# EAGLE design optoisolator-shield (EAGLE 7.6.0)
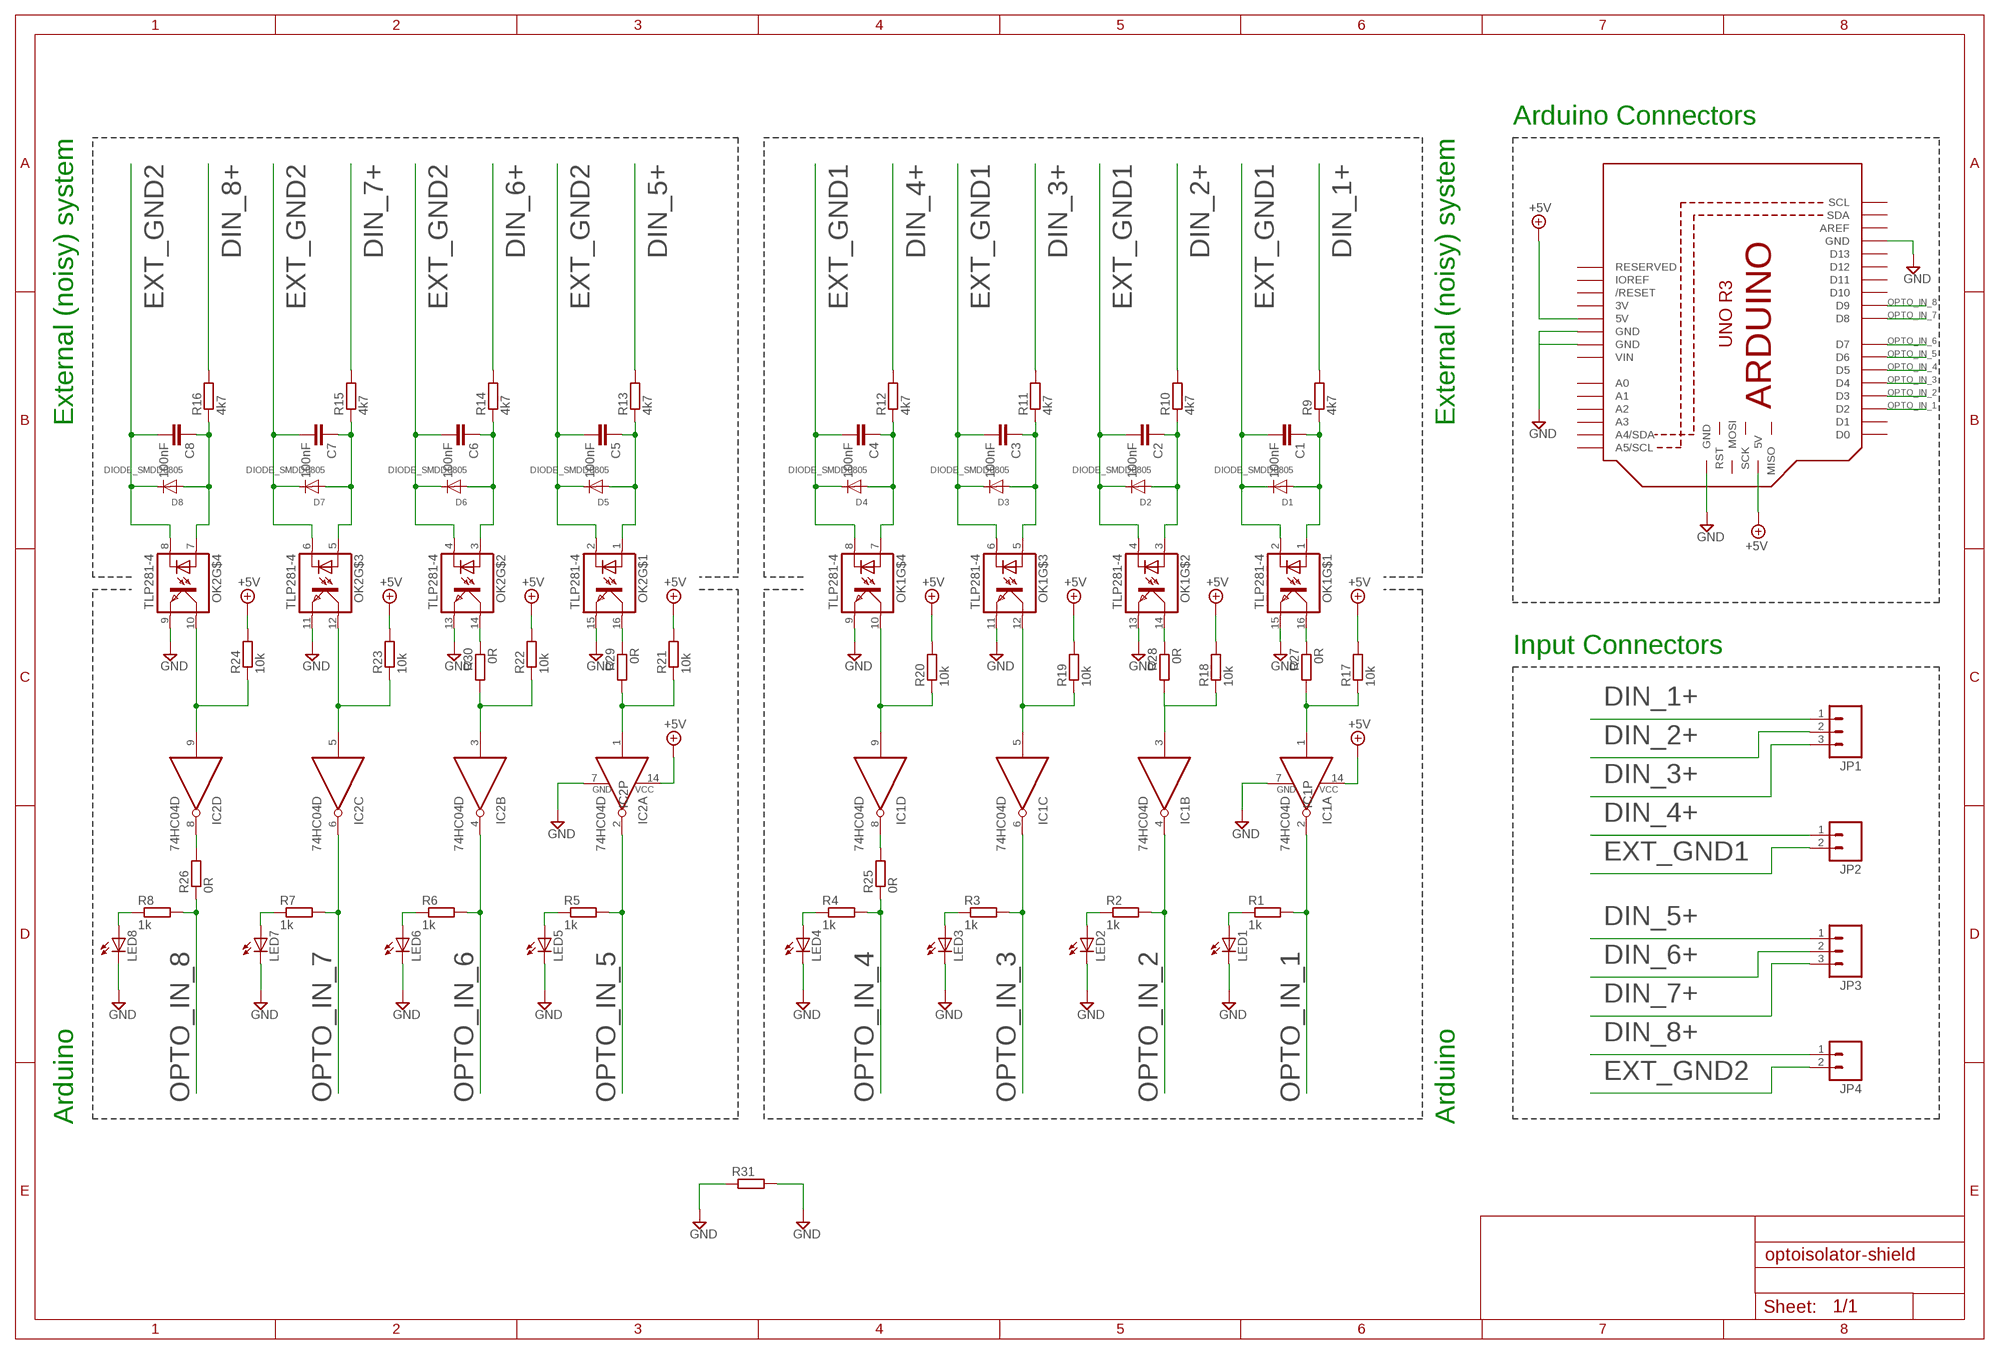
[diagram p0: schematic, sheet 1]

## Parts
C1  100nF  C-EUC0603K  [C0603K]
C2  100nF  C-EUC0603K  [C0603K]
C3  100nF  C-EUC0603K  [C0603K]
C4  100nF  C-EUC0603K  [C0603K]
C5  100nF  C-EUC0603K  [C0603K]
C6  100nF  C-EUC0603K  [C0603K]
C7  100nF  C-EUC0603K  [C0603K]
C8  100nF  C-EUC0603K  [C0603K]
D1  DIODE_SMDD0805  [D0805]
D2  DIODE_SMDD0805  [D0805]
D3  DIODE_SMDD0805  [D0805]
D4  DIODE_SMDD0805  [D0805]
D5  DIODE_SMDD0805  [D0805]
D6  DIODE_SMDD0805  [D0805]
D7  DIODE_SMDD0805  [D0805]
D8  DIODE_SMDD0805  [D0805]
IC1  74HC04D  [SO14]
IC2  74HC04D  [SO14]
JP1  M03SCREW_LOCK  [SCREWTERMINAL-3.5MM-3_LOCK.007S]
JP2  M023.5MM  [SCREWTERMINAL-3.5MM-2]
JP3  M03SCREW_LOCK  [SCREWTERMINAL-3.5MM-3_LOCK.007S]
JP4  M023.5MM  [SCREWTERMINAL-3.5MM-2]
LED1  LEDSML1206  [SML1206]
LED2  LEDSML1206  [SML1206]
LED3  LEDSML1206  [SML1206]
LED4  LEDSML1206  [SML1206]
LED5  LEDSML1206  [SML1206]
LED6  LEDSML1206  [SML1206]
LED7  LEDSML1206  [SML1206]
LED8  LEDSML1206  [SML1206]
M1  ARDUINO_R3_ICSP  [ARDUINOR3_ICSP]
OK1  TLP281-4  [MINI-FLAT-16]
OK2  TLP281-4  [MINI-FLAT-16]
R1  1k  R-EU_R0603  [R0603]
R2  1k  R-EU_R0603  [R0603]
R3  1k  R-EU_R0603  [R0603]
R4  1k  R-EU_R0603  [R0603]
R5  1k  R-EU_R0603  [R0603]
R6  1k  R-EU_R0603  [R0603]
R7  1k  R-EU_R0603  [R0603]
R8  1k  R-EU_R0603  [R0603]
R9  4k7  R-EU_R0603  [R0603]
R10  4k7  R-EU_R0603  [R0603]
R11  4k7  R-EU_R0603  [R0603]
R12  4k7  R-EU_R0603  [R0603]
R13  4k7  R-EU_R0603  [R0603]
R14  4k7  R-EU_R0603  [R0603]
R15  4k7  R-EU_R0603  [R0603]
R16  4k7  R-EU_R0603  [R0603]
R17  10k  R-EU_R0603  [R0603]
R18  10k  R-EU_R0603  [R0603]
R19  10k  R-EU_R0603  [R0603]
R20  10k  R-EU_R0603  [R0603]
R21  10k  R-EU_R0603  [R0603]
R22  10k  R-EU_R0603  [R0603]
R23  10k  R-EU_R0603  [R0603]
R24  10k  R-EU_R0603  [R0603]
R25  0R  R-EU_R2010  [R2010]
R26  0R  R-EU_R2010  [R2010]
R27  0R  R-EU_R2010  [R2010]
R28  0R  R-EU_R2010  [R2010]
R29  0R  R-EU_R2010  [R2010]
R30  0R  R-EU_R2010  [R2010]
R31  R-EU_R1206  [R1206]

## Nets
+5V: IC1.14(P:VCC) IC2.14(P:VCC) M1.5V M1.5V_ICSP(5V) R17.2 R18.2 R19.2 R20.2 R21.2 R22.2 R23.2 R24.2
DIN_1+: JP1.1 R9.2
DIN_2+: JP1.2 R10.2
DIN_3+: JP1.3 R11.2
DIN_4+: JP2.1 R12.2
DIN_5+: JP3.1 R13.2
DIN_6+: JP3.2 R14.2
DIN_7+: JP3.3 R15.2
DIN_8+: JP4.1 R16.2
EXT_GND1: C1.2 C2.2 C3.2 C4.2 D1.K D2.K D3.K D4.K JP2.2 OK1.2(C) OK1.4(C) OK1.6(C) OK1.8(C)
EXT_GND2: C5.2 C6.2 C7.2 C8.2 D5.K D6.K D7.K D8.K JP4.2 OK2.2(C) OK2.4(C) OK2.6(C) OK2.8(C)
GND: IC1.7(P:GND) IC2.7(P:GND) LED1.C LED2.C LED3.C LED4.C LED5.C LED6.C LED7.C LED8.C M1.GND M1.GND@1(GND) M1.GND@2(GND) M1.GND@3(GND) OK1.9(EMIT) OK1.11(EMIT) OK1.13(EMIT) OK1.15(EMIT) OK2.9(EMIT) OK2.11(EMIT) OK2.13(EMIT) OK2.15(EMIT) R31.1 R31.2
N$1: IC1.1(A:I) R17.1 R27.2
N$2: IC1.3(B:I) R18.1 R28.2
N$3: IC1.5(C:I) OK1.12(COL) R19.1
N$4: IC1.9(D:I) OK1.10(COL) R20.1
N$5: IC2.1(A:I) R21.1 R29.2
N$6: IC2.3(B:I) R22.1 R30.2
N$7: IC2.5(C:I) OK2.12(COL) R23.1
N$8: IC2.9(D:I) OK2.10(COL) R24.1
N$9: OK2.16(COL) R29.1
N$10: IC1.8(D:O) R25.2
N$11: IC2.8(D:O) R26.2
N$12: OK1.16(COL) R27.1
N$13: OK1.14(COL) R28.1
N$14: OK2.14(COL) R30.1
N$17: C1.1 D1.A OK1.1(A) R9.1
N$18: C2.1 D2.A OK1.3(A) R10.1
N$19: C3.1 D3.A OK1.5(A) R11.1
N$20: C4.1 D4.A OK1.7(A) R12.1
N$21: C5.1 D5.A OK2.1(A) R13.1
N$22: C6.1 D6.A OK2.3(A) R14.1
N$23: C7.1 D7.A OK2.5(A) R15.1
N$24: C8.1 D8.A OK2.7(A) R16.1
N$25: LED1.A R1.1
N$26: LED2.A R2.1
N$27: LED3.A R3.1
N$28: LED4.A R4.1
N$29: LED5.A R5.1
N$30: LED6.A R6.1
N$31: LED7.A R7.1
N$32: LED8.A R8.1
OPTO_IN_1: IC1.2(A:O) M1.D2 R1.2
OPTO_IN_2: IC1.4(B:O) M1.D3 R2.2
OPTO_IN_3: IC1.6(C:O) M1.D4 R3.2
OPTO_IN_4: M1.D5 R4.2 R25.1
OPTO_IN_5: IC2.2(A:O) M1.D6 R5.2
OPTO_IN_6: IC2.4(B:O) M1.D7 R6.2
OPTO_IN_7: IC2.6(C:O) M1.D8 R7.2
OPTO_IN_8: M1.D9 R8.2 R26.1
Unconnected: IC1.10(E:O) IC1.11(E:I) IC1.12(F:O) IC1.13(F:I) IC2.10(E:O) IC2.11(E:I) IC2.12(F:O) IC2.13(F:I) M1.A0 M1.A1 M1.A2 M1.A3 M1.A4(A4/SDA) M1.A5(A5/SCL) M1.AREF M1.D0 M1.D1 M1.D10 M1.D11 M1.D12 M1.D13 M1.IOREF M1.MISO M1.MOSI M1.RESERVED M1.RESET(/RESET) M1.RESET_ICSP(RST) M1.SCK M1.SCL M1.SDA

## Notes on the sheet
- Arduino Connectors
- External (noisy) system | External (noisy) system
- Input Connectors
- Arduino | Arduino

## Power pins joined to a net without a drawn wire
3V: M1.3V
VIN: M1.VIN

## Library data of the parts
C1-C8 = rcl:C-EU: CAPACITOR, European symbol
D1-D8 = diodes_gen:DIODE_SMD: General Purpose Diode Library Unspecified diode types but packages D0805 doplnit D0605 D1206 SMA SMB SMC SOD123 SOD323 Diodes in 0603 package Typ Farnell number Link Notes TS4148RZG 8150192 Link <http://cz.farnell.com/taiwan-semiconductor/ts4148-rzg/diode-0-35a-603/dp/8150192> 1N41448 alt CD0603-S01xxx 7599754 Link <http://cz.farnell.com/bourns/cd0603-s0180r/switching-diode-90v-100ma-0603/dp/7599754> 1N41448 alt Diodes in 0805 package Typ Farnell number Link Notes TS4148RY 8150206 Link <http://cz.farnell.com/taiwan-semiconductor/ts4148-ry/diode-0-5a-0805-100v/dp/8150206> 1n4148 alt Diodes in 1202 package Typ Farnell number Link Notes TS4148RX 8150214 Link <http://cz.farnell.com/taiwan-semiconductor/ts4148-rx/diode-small-signal-100v-0-15a-1206/dp/8150214> CD1206-S01575 7599821 Link <http://cz.farnell.com/bourns/cd1206-s01575/switching-diode-100v-150ma-1206/dp/7599821> Diodes in SOD123 package Typ Farnell number Link Notes Link Diodes in SOD323 package Typ Farnell number Link Notes Link Diodes in SMA package Typ Farnell number Link Notes Link Diodes in SMB package Typ Farnell number Link Notes Link Diodes in SMC package Typ Farnell number Link Notes Link
IC1 IC2 = 74xx-eu:74*04: Hex INVERTER
JP1 JP3 = SparkFunOld:M03: Header 3 Standard 3-pin 0.1" header. Use with straight break away headers (SKU : PRT-00116), right angle break away headers (PRT-00553), swiss pins (PRT-00743), machine pins (PRT-00117), and female headers (PRT-00115). Molex polarized connector foot print use with SKU : PRT-08232 with associated crimp pins and housings.
JP2 JP4 = SparkFunOld:M02: Header 2 Standard 2-pin 0.1" header. Use with straight break away headers (SKU : PRT-00116), right angle break away headers (PRT-00553), swiss pins (PRT-00743), machine pins (PRT-00117), and female headers (PRT-00115). Molex polarized connector foot print use with SKU : PRT-08233 with associated crimp pins and housings.
LED1-LED8 = led:LED: LED OSRAM: - CHIPLED LG R971, LG N971, LY N971, LG Q971, LY Q971, LO R971, LY R971 LH N974, LH R974 LS Q976, LO Q976, LY Q976 LO Q996 - Hyper CHIPLED LW Q18S LB Q993, LB Q99A, LB R99A - SideLED LS A670, LO A670, LY A670, LG A670, LP A670 LB A673, LV A673, LT A673, LW A673 LH A674 LY A675 LS A676, LA A676, LO A676, LY A676, LW A676 LS A679, LY A679, LG A679 - Hyper Micro SIDELED® LS Y876, LA Y876, LO Y876, LY Y876 LT Y87S - SmartLED LW L88C, LW L88S LB L89C, LB L89S, LG L890 LS L89K, LO L89K, LY L89K LS L896, LA L896, LO L896, LY L896 - TOPLED LS T670, LO T670, LY T670, LG T670, LP T670 LSG T670, LSP T670, LSY T670, LOP T670, LYG T670 LG T671, LOG T671, LSG T671 LB T673, LV T673, LT T673, LW T673 LH T674 LS T676, LA T676, LO T676, LY T676, LB T676, LH T676, LSB T676, LW T676 LB T67C, LV T67C, LT T67C, LS T67K, LO T67K, LY T67K, LW E67C LS E67B, LA E67B, LO E67B, LY E67B, LB E67C, LV E67C, LT E67C LW T67C LS T679, LY T679, LG T679 LS T770, LO T770, LY T770, LG T770, LP T770 LB T773, LV T773, LT T773, LW T773 LH T774 LS E675, LA E675, LY E675, LS T675 LS T776, LA T776, LO T776, LY T776, LB T776 LHGB T686 LT T68C, LB T68C - Hyper Mini TOPLED® LB M676 - Mini TOPLED Santana® LG M470 LS M47K, LO M47K, LY M47K Source: http://www.osram.convergy.de LUXEON: - LUMILED® LXK2-PW12-R00, LXK2-PW12-S00, LXK2-PW14-U00, LXK2-PW14-V00 LXK2-PM12-R00, LXK2-PM12-S00, LXK2-PM14-U00 LXK2-PE12-Q00, LXK2-PE12-R00, LXK2-PE12-S00, LXK2-PE14-T00, LXK2-PE14-U00 LXK2-PB12-K00, LXK2-PB12-L00, LXK2-PB12-M00, LXK2-PB14-N00, LXK2-PB14-P00, LXK2-PB14-Q00 LXK2-PR12-L00, LXK2-PR12-M00, LXK2-PR14-Q00, LXK2-PR14-R00 LXK2-PD12-Q00, LXK2-PD12-R00, LXK2-PD12-S00 LXK2-PH12-R00, LXK2-PH12-S00 LXK2-PL12-P00, LXK2-PL12-Q00, LXK2-PL12-R00 Source: www.luxeon.com KINGBRIGHT: KA-3528ASYC Source: www.kingbright.com
M1 = adafruit:ARDUINO_R3_ICSP
OK1 OK2 = optocoupler:TLP281-4: TOSHIBA PHOTOCOUPLER GaAs IRED & PHOTO-TRANSISTOR Source: http://www.alldatasheet.com/datasheet-pdf/pdf/32424/TOSHIBA/TLP281.html214960/TOSHIBA/TLP281-4.html
R1-R24 = rcl:R-EU_: RESISTOR, European symbol
R25-R31 = resistor:R-EU_: RESISTOR, European symbol

## Board
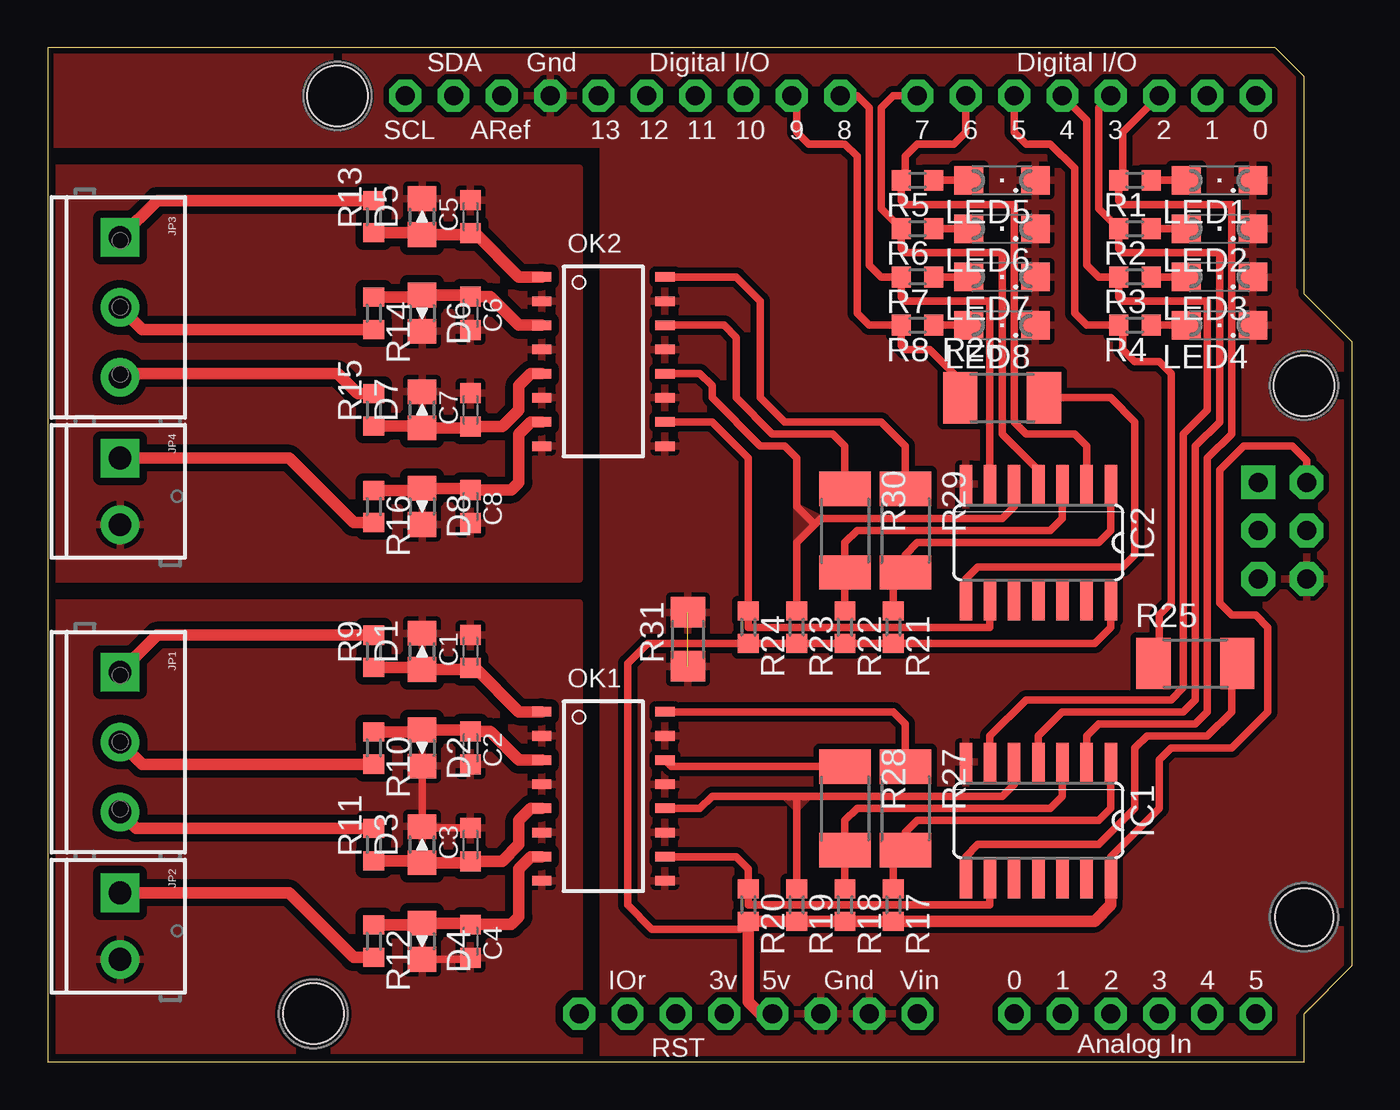
[diagram p1: board, top side]

Size 68.58 x 53.34 mm. Coordinates in mm from the lower left corner, seen from the top.
Copper layers (1*16): Top 0.035mm / dielectric 1.5mm / Bottom 0.035mm
Design rules "default *": minimum track width 40mil, minimum drill 24mil, track to track 8mil, track to pad 8mil, pad to pad 8mil, via to via 8mil, smd to smd 8mil, copper to edge 12mil, drill to drill 8mil, minimum pad ring 10mil, minimum via ring 8mil, stop-mask expansion 4mil, vias tented up to drill 0mil, thermal gap 10mil
Holes 3.17 mm at 13.97,2.54 15.24,50.8 66.04,35.56
Holes 3.05 mm at 66.04,7.62

### Footprints (pad centres in the part's own frame; a part is rotated, then mirrored left to right if it is on the bottom)
C0603K = smd 1.05 x 1.08: 1 -0.875,0; 2 0.875,0
D0805 = smd 1.3 x 1.5: A -0.95,0; K 0.95,0
SO14 = smd 0.66 x 2.032: 1 -3.81,-3.073; 2 -2.54,-3.073; 3 -1.27,-3.073; 4 0,-3.073; 5 1.27,-3.073; 6 2.54,-3.073; 7 3.81,-3.073; 8 3.81,3.073; 9 2.54,3.073; 10 1.27,3.073; 11 0,3.073; 12 -1.27,3.073; 13 -2.54,3.073; 14 -3.81,3.073
SCREWTERMINAL-3.5MM-3_LOCK.007S = drill 1.2 pad 2.032 square: 1 -0.178,0 | drill 1.2 pad 2.032: 2 3.5,0; 3 7.178,0
SCREWTERMINAL-3.5MM-2 = drill 1.2 pad 2.032 square: 1 0,0 | drill 1.2 pad 2.032: 2 3.5,0
SML1206 = smd 1.5 x 1.5: A 1.75,0; C -1.75,0
ARDUINOR3_ICSP = drill 1 pad 1.676 octagon: 3V 35.56,2.54; 5V 38.1,2.54; A0 50.8,2.54; A1 53.34,2.54; A2 55.88,2.54; A3 58.42,2.54; A4 60.96,2.54; A5 63.5,2.54; AREF 23.876,50.8; D0 63.5,50.8; D1 60.96,50.8; D2 58.42,50.8; D3 55.88,50.8; D4 53.34,50.8; D5 50.8,50.8; D6 48.26,50.8; D7 45.72,50.8; D8 41.656,50.8; D9 39.116,50.8; D10 36.576,50.8; D11 34.036,50.8; D12 31.496,50.8; D13 28.956,50.8; GND 26.416,50.8; GND@1 43.18,2.54; GND@2 40.64,2.54; IOREF 30.48,2.54; RESERVED 27.94,2.54; RESET 33.02,2.54; SCL 18.796,50.8; SDA 21.336,50.8; VIN 45.72,2.54 | drill 1 pad 1.778 octagon: 5V_ICSP 66.167,30.48; GND@3 66.167,25.4; MOSI 66.167,27.94; RESET_ICSP 63.627,25.4; SCK 63.627,27.94 | drill 1 pad 1.778 square: MISO 63.627,30.48
MINI-FLAT-16 = smd 1 x 0.5: 1 -3.24,4.445; 2 -3.24,3.175; 3 -3.24,1.905; 4 -3.24,0.635; 5 -3.24,-0.635; 6 -3.24,-1.905; 7 -3.24,-3.175; 8 -3.24,-4.445; 9 3.24,-4.445; 10 3.24,-3.175; 11 3.24,-1.905; 12 3.24,-0.635; 13 3.24,0.635; 14 3.24,1.905; 15 3.24,3.175; 16 3.24,4.445
R0603 = smd 1 x 1.1: 1 -0.85,0; 2 0.85,0
R2010 = smd 1.8 x 2.7: 1 -2.2,0; 2 2.2,0
R1206 = smd 1.6 x 1.803: 1 -1.422,0; 2 1.422,0

### Placement (x,y rotation side)
C1  22.23,21.59 90 top
C2  22.23,16.51 270 top
C3  22.23,11.43 90 top
C4  22.23,6.35 270 top
C5  22.23,44.45 90 top
C6  22.23,39.37 270 top
C7  22.23,34.29 90 top
C8  22.23,29.21 270 top
D1  19.68,21.59 90 top
D2  19.68,16.51 270 top
D3  19.68,11.43 90 top
D4  19.68,6.35 270 top
D5  19.68,44.45 90 top
D6  19.68,39.37 270 top
D7  19.68,34.29 90 top
D8  19.68,29.21 270 top
IC1  52.07,12.7 180 top
IC2  52.07,27.3 180 top
JP1  3.81,20.32 270 top
JP2  3.81,8.89 270 top
JP3  3.81,43.18 270 top
JP4  3.81,31.75 270 top
LED1  61.59,46.35 180 top
LED2  61.59,43.81 180 top
LED3  61.59,41.27 180 top
LED4  61.59,38.73 180 top
LED5  50.16,46.35 180 top
LED6  50.16,43.81 180 top
LED7  50.16,41.27 180 top
LED8  50.16,38.73 180 top
M1  0,0 0 top
OK1  29.21,13.97 0 top
OK2  29.21,36.83 0 top
R1  57.15,46.35 180 top
R2  57.15,43.81 180 top
R3  57.15,41.27 180 top
R4  57.15,38.73 180 top
R5  45.72,46.35 180 top
R6  45.72,43.81 180 top
R7  45.72,41.27 180 top
R8  45.72,38.73 180 top
R9  17.14,21.59 90 top
R10  17.14,16.51 270 top
R11  17.14,11.43 90 top
R12  17.14,6.35 270 top
R13  17.14,44.45 90 top
R14  17.14,39.37 270 top
R15  17.14,34.29 90 top
R16  17.14,29.21 270 top
R17  44.45,8.26 270 top
R18  41.91,8.26 270 top
R19  39.37,8.26 270 top
R20  36.83,8.26 270 top
R21  44.45,22.86 270 top
R22  41.91,22.86 270 top
R23  39.37,22.86 270 top
R24  36.83,22.86 270 top
R25  60.33,20.95 0 top
R26  50.16,34.92 0 top
R27  45.09,13.34 270 top
R28  41.91,13.34 270 top
R29  45.09,27.94 270 top
R30  41.91,27.94 270 top
R31  33.66,22.23 90 top

### Tracks (layer width: path | path; a pad name or v marks a point on that pad's centre or on a via)
+5V
  Top 0.406: IC2.14 55.88,22.86 55.03,22.01 R21.2 R22.2 R23.2 R24.2 31.54,22.01 30.48,20.95 30.48,8.26 31.75,6.99 36.41,6.99 R20.2 | IC1.14 55.88,10.79 58.42,13.34 58.42,15.88 59.05,16.51 62.23,16.51 64.14,18.41 64.14,22.86 63.5,23.5 62.23,23.5 61.59,24.13 61.59,31.11 62.87,32.38 65.41,32.38 66.17,31.62 M1.5V_ICSP
  Top 0.61: IC1.14 55.88,8.26 55.03,7.41 R17.2 R18.2 R19.2 R20.2 36.83,3.17 37.47,2.54 M1.5V
DIN_1+
  Top 0.61: R9.2 5.75,22.44 JP1.1
DIN_2+
  Top 0.61: R10.2 4.97,15.66 JP1.2
DIN_3+
  Top 0.61: R11.2 4.67,12.28 JP1.3
DIN_4+
  Top 0.61: R12.2 16.09,5.5 12.7,8.89 JP2.1
DIN_5+
  Top 0.61: R13.2 5.75,45.3 JP3.1
DIN_6+
  Top 0.61: R14.2 4.97,38.52 JP3.2
DIN_7+
  Top 0.61: R15.2 16.3,35.14 15.24,36.2 4,36.2 JP3.3
DIN_8+
  Top 0.61: R16.2 16.09,28.36 12.7,31.75 JP4.1
EXT_GND1
  Top 0.406: C3.2 19.76,12.3 D3.K D2.K | D4.K 22.15,5.4 C4.2
  pour Top (isolate 0.406): 0,24.13 27.94,24.13 27.94,0 0,0
EXT_GND2
  pour Top (isolate 0.406): 0,46.99 27.94,46.99 27.94,25.4 0,25.4
GND  (1 unrouted)
  pour Top (isolate 0.305): 0,48.26 29.21,48.26 29.21,0 65.41,0 65.41,2.54 67.94,5.08 67.94,38.1 65.41,40.64 65.41,52.07 64.14,53.34 0,53.34
N$1
  Top 0.406: IC1.1 55.88,13.34 55.24,12.7 45.72,12.7 45.09,12.06 R27.2 44.79,11.43 44.45,11.43 R17.1
N$2
  Top 0.406: IC1.3 53.34,13.97 52.7,13.34 42.55,13.34 41.91,12.7 R28.2 R18.1
N$3
  Top 0.406: 39.37,13.97 34.92,13.97 34.29,13.34 OK1.12 | 39.37,13.97 50.16,13.97 50.8,14.61 IC1.5 | R19.1 39.37,13.97
  pour Top: 38.73,13.97 39.37,13.34 40.01,13.97
N$4
  Top 0.406: IC1.9 49.53,8.26 36.83,8.26 R20.1 36.83,10.16 36.2,10.79 OK1.10
N$5
  Top 0.406: R21.1 44.45,25.11 R29.2 45.09,26.67 45.72,27.3 55.24,27.3 55.88,27.94 IC2.1
N$6
  Top 0.406: IC2.3 53.34,28.57 52.7,27.94 42.55,27.94 41.91,27.3 R30.2 R22.1
N$7
  Top 0.406: R23.1 39.37,27.3 40.32,28.26 | 40.32,28.26 40.64,28.57 50.16,28.57 50.8,29.21 IC2.5 | OK2.12 34.29,36.2 34.92,35.56 34.92,34.92 37.47,32.38 38.73,32.38 39.37,31.75 39.37,29.21 40.32,28.26
  pour Top: 39.37,29.21 39.37,27.3 40.64,28.57
N$8
  Top 0.406: IC2.9 49.53,22.86 36.83,22.86 R24.1 36.83,31.75 34.92,33.66 OK2.10
N$9
  Top 0.406: R29.1 45.09,32.38 43.81,33.66 38.73,33.66 37.47,34.92 37.47,40.01 36.2,41.27 OK2.16
N$10
  Top 0.406: IC1.8 48.26,10.79 48.9,11.43 55.24,11.43 57.15,13.34 57.15,16.51 57.78,17.14 60.96,17.14 62.23,18.41 62.23,21.93 R25.2
N$11
  Top 0.406: R26.2 55.88,34.92 57.15,33.66 57.15,26.67 56.52,26.04 48.9,26.04 48.26,25.4 IC2.8
N$12
  Top 0.406: R27.1 45.09,17.78 44.45,18.41 OK1.16
N$13
  Top 0.406: R28.1 32.79,15.54 OK1.14
N$14
  Top 0.406: R30.1 41.91,32.38 41.27,33.02 38.1,33.02 36.2,34.92 36.2,38.1 35.56,38.73 OK2.14
N$17
  Top 0.406: 19.59,20.74 D1.A | 22.15,20.64 C1.1 22.46,20.71
  Top 0.61: R9.1 19.59,20.74 | D1.A 22.15,20.64 | 22.46,20.71 24.77,18.41 OK1.1
N$18
  Top 0.406: 19.59,17.36 D2.A | 22.15,17.46 C2.1
  Top 0.61: R10.1 19.59,17.36 | D2.A 22.15,17.46 | C2.1 23.25,17.39 24.77,15.88 OK1.3
N$19
  Top 0.406: 19.59,10.58 D3.A | 22.15,10.48 C3.1
  Top 0.61: R11.1 19.59,10.58 | D3.A 22.15,10.48 | C3.1 23.89,10.55 24.77,11.43 24.77,12.7 25.4,13.34 OK1.5
N$20
  Top 0.406: 19.59,7.2 D4.A | 22.15,7.3 C4.1
  Top 0.61: R12.1 19.59,7.2 | D4.A 22.15,7.3 | C4.1 24.37,7.22 24.77,7.62 24.77,10.16 25.4,10.79 OK1.7
N$21
  Top 0.406: C5.1 22.46,43.58
  Top 0.61: R13.1 19.59,43.6 D5.A 22.15,43.5 C5.1 | 22.46,43.58 24.77,41.27 OK2.1
N$22
  Top 0.61: R14.1 19.59,40.22 D6.A 22.15,40.32 C6.1 23.25,40.24 24.77,38.73 OK2.3
N$23
  Top 0.61: R15.1 19.59,33.44 D7.A 22.15,33.34 C7.1 23.89,33.41 24.77,34.29 24.77,35.56 25.4,36.2 OK2.5
N$24
  Top 0.61: R16.1 19.59,30.06 D8.A 22.15,30.16 C8.1 24.37,30.09 24.77,30.48 24.77,33.02 25.4,33.66 OK2.7
N$25
  Top 0.406: R1.1 LED1.A
N$26
  Top 0.406: R2.1 LED2.A
N$27
  Top 0.406: R3.1 LED3.A
N$28
  Top 0.406: R4.1 LED4.A
N$29
  Top 0.406: LED5.A R5.1
N$30
  Top 0.406: LED6.A R6.1
N$31
  Top 0.406: LED7.A R7.1
N$32
  Top 0.406: LED8.A R8.1
OPTO_IN_1
  Top 0.406: IC1.2 54.61,17.14 55.24,17.78 60.33,17.78 60.96,18.41 60.96,31.75 62.23,33.02 62.23,45.09 56.52,45.09 56.3,45.3 R1.2 56.52,46.57 56.52,48.9 M1.D2
OPTO_IN_2
  Top 0.406: IC1.4 52.07,17.14 53.34,18.41 59.69,18.41 60.33,19.05 60.33,32.38 61.59,33.66 61.59,42.55 56.52,42.55 56.3,42.76 R2.2 55.24,44.87 55.24,50.16 M1.D3
OPTO_IN_3
  Top 0.406: IC1.6 49.53,17.14 51.44,19.05 59.05,19.05 59.69,19.68 59.69,33.02 60.96,34.29 60.96,40.01 56.52,40.01 56.3,40.22 R3.2 55.24,41.27 54.61,41.91 54.61,49.53 M1.D4
OPTO_IN_4
  Top 0.406: R25.1 58.12,21.59 58.42,21.59 58.42,23.5 59.05,24.13 59.05,36.2 58.42,36.83 57.15,36.83 56.52,37.47 56.52,38.52 R4.2 54.61,38.73 53.98,39.37 53.98,46.99 52.7,48.26 51.44,48.26 50.8,48.9 M1.D5
OPTO_IN_5
  Top 0.406: IC2.2 54.61,32.38 53.98,33.02 51.44,33.02 50.8,33.66 50.8,45.09 45.09,45.09 44.87,45.3 R5.2 45.09,46.57 45.09,47.62 45.72,48.26 47.62,48.26 48.26,48.9 M1.D6
OPTO_IN_6
  Top 0.406: IC2.4 52.07,31.11 50.16,33.02 50.16,42.55 45.09,42.55 44.87,42.76 R6.2 43.81,44.87 43.81,50.16 44.45,50.8 M1.D7
OPTO_IN_7
  Top 0.406: IC2.6 49.53,40.01 45.09,40.01 44.87,40.22 R7.2 43.81,41.27 43.18,41.91 43.18,50.16 42.55,50.8 M1.D8
OPTO_IN_8
  Top 0.406: R26.1 48.26,35.22 48.26,35.56 46.35,37.47 45.09,37.47 44.87,37.68 R8.2 43.18,38.73 42.55,39.37 42.55,47.62 41.91,48.26 40.01,48.26 39.37,48.9 39.37,50.55 M1.D9